# EAGLE design SingleMotor (EAGLE 6.6.0)
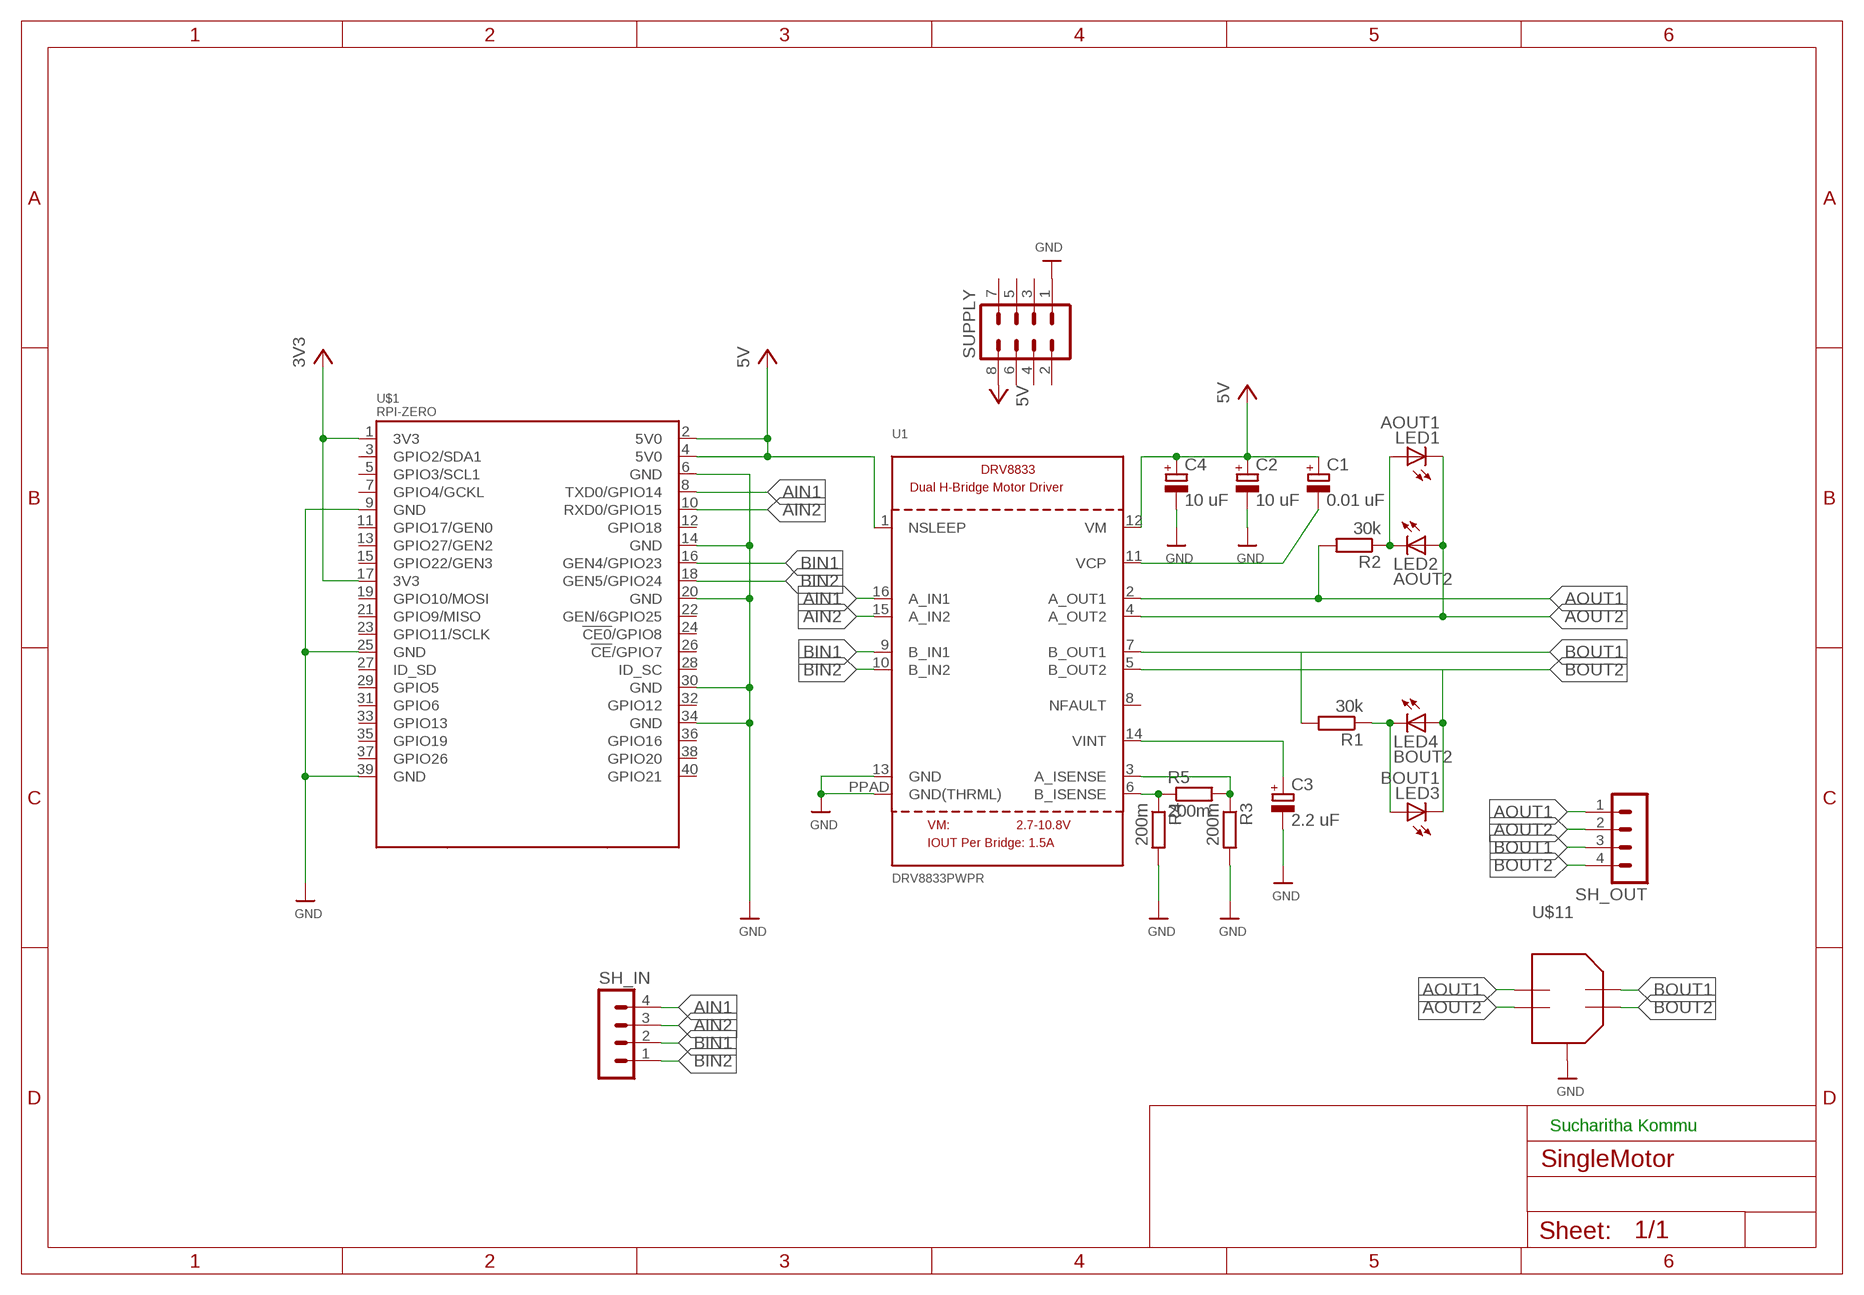
[diagram p0: schematic, sheet 1]

## Parts
C1  0.01 uF  CPOL-EUSMCC  [SMC_C]
C2  10 uF  CPOL-EUE2.5-6  [E2,5-6]
C3  2.2 uF  CPOL-EUSMCC  [SMC_C]
C4  10 uF  CPOL-EUE3.5-8  [E3,5-8]
LED1  AOUT1  LED5MM  [LED5MM]
LED2  AOUT2  LED5MM  [LED5MM]
LED3  BOUT1  LED5MM  [LED5MM]
LED4  BOUT2  LED5MM  [LED5MM]
R1  30k  R-EU_0204/2V  [0204V]
R2  30k  R-EU_0204/2V  [0204V]
R3  200m  R-EU_0204/2V  [0204V]
R4  200m  R-EU_0204/2V  [0204V]
R5  200m  R-EU_0204/2V  [0204V]
SH_IN  MA04-1  [MA04-1]
SH_OUT  MA04-1  [MA04-1]
SUPPLY  MA04-2  [MA04-2]
U1  DRV8833PWPR  DRV8833  [HTSSOP16]
U$1  RPI-ZERO  [RASPBERRYPI_BASTELSTUBE_V13_RASPI_BOARD_B+_FULL]
U$11  M80-85104XX"  [M80-85104XX]

## Nets
3V3: U$1.1(3V3) U$1.17(3V3)
5V: U1.1(NSLEEP) U$1.2(5V0) U$1.4(5V0)
AIN1: SH_IN.4 U1.16(A_IN1) U$1.8(TXD0/GPIO14)
AIN2: SH_IN.3 U1.15(A_IN2) U$1.10(RXD0/GPIO15)
AOUT1: R2.2 SH_OUT.1 U1.2(A_OUT1) U$11.P1
AOUT2: LED1.K(C) LED2.A SH_OUT.2 U1.4(A_OUT2) U$11.P3
BIN1: SH_IN.2 U1.9(B_IN1) U$1.16(GEN4/GPIO23)
BIN2: SH_IN.1 U1.10(B_IN2) U$1.18(GEN5/GPIO24)
BOUT1: R1.2 SH_OUT.3 U1.7(B_OUT1) U$11.P2
BOUT2: LED3.K(C) LED4.A SH_OUT.4 U1.5(B_OUT2) U$11.P4
GND: C1.- C2.- C3.- C4.- R3.2 R4.2 SUPPLY.1 U1.11(VCP) U1.13(GND) U1.PPAD(GND(THRML)) U$1.6(GND) U$1.9(GND) U$1.14(GND) U$1.20(GND) U$1.25(GND) U$1.30(GND) U$1.34(GND) U$1.39(GND) U$11.CASE1(CASE) U$11.CASE2(CASE) U$11.CASE3(CASE) U$11.CASE4(CASE)
N$5: LED1.A LED2.K(C) R2.1
N$7: LED3.A LED4.K(C) R1.1
N$11: C3.+ U1.14(VINT)
N$12: R3.1 R5.2 U1.3(A_ISENSE)
N$13: R4.1 R5.1 U1.6(B_ISENSE)
VCC: C1.+ C2.+ C4.+ SUPPLY.8 U1.12(VM) ; supply symbol labelled 5V
Unconnected: SUPPLY.2 SUPPLY.3 SUPPLY.4 SUPPLY.5 SUPPLY.6 SUPPLY.7 U1.8(NFAULT) U$1.3(GPIO2/SDA1) U$1.5(GPIO3/SCL1) U$1.7(GPIO4/GCKL) U$1.11(GPIO17/GEN0) U$1.12(GPIO18) U$1.13(GPIO27/GEN2) U$1.15(GPIO22/GEN3) U$1.19(GPIO10/MOSI) U$1.21(GPIO9/MISO) U$1.22(GEN/6GPIO25) U$1.23(GPIO11/SCLK) U$1.24(!CE0!/GPIO8) U$1.26(!CE!/GPIO7) U$1.27(ID_SD) U$1.28(ID_SC) U$1.29(GPIO5) U$1.31(GPIO6) U$1.32(GPIO12) U$1.33(GPIO13) U$1.35(GPIO19) U$1.36(GPIO16) U$1.37(GPIO26) U$1.38(GPIO20) U$1.40(GPIO21)

## Notes on the sheet
- Sucharitha Kommu

## Library data of the parts
C1 C3 = resistor:CPOL-EU: POLARIZED CAPACITOR, European symbol
C2 C4 = rcl:CPOL-EU: POLARIZED CAPACITOR, European symbol
LED1-LED4 = led:LED: LED OSRAM: - CHIPLED LG R971, LG N971, LY N971, LG Q971, LY Q971, LO R971, LY R971 LH N974, LH R974 LS Q976, LO Q976, LY Q976 LO Q996 - Hyper CHIPLED LW Q18S LB Q993, LB Q99A, LB R99A - SideLED LS A670, LO A670, LY A670, LG A670, LP A670 LB A673, LV A673, LT A673, LW A673 LH A674 LY A675 LS A676, LA A676, LO A676, LY A676, LW A676 LS A679, LY A679, LG A679 - Hyper Micro SIDELED® LS Y876, LA Y876, LO Y876, LY Y876 LT Y87S - SmartLED LW L88C, LW L88S LB L89C, LB L89S, LG L890 LS L89K, LO L89K, LY L89K LS L896, LA L896, LO L896, LY L896 - TOPLED LS T670, LO T670, LY T670, LG T670, LP T670 LSG T670, LSP T670, LSY T670, LOP T670, LYG T670 LG T671, LOG T671, LSG T671 LB T673, LV T673, LT T673, LW T673 LH T674 LS T676, LA T676, LO T676, LY T676, LB T676, LH T676, LSB T676, LW T676 LB T67C, LV T67C, LT T67C, LS T67K, LO T67K, LY T67K, LW E67C LS E67B, LA E67B, LO E67B, LY E67B, LB E67C, LV E67C, LT E67C LW T67C LS T679, LY T679, LG T679 LS T770, LO T770, LY T770, LG T770, LP T770 LB T773, LV T773, LT T773, LW T773 LH T774 LS E675, LA E675, LY E675, LS T675 LS T776, LA T776, LO T776, LY T776, LB T776 LHGB T686 LT T68C, LB T68C - Hyper Mini TOPLED® LB M676 - Mini TOPLED Santana® LG M470 LS M47K, LO M47K, LY M47K Source: http://www.osram.convergy.de LUXEON: - LUMILED® LXK2-PW12-R00, LXK2-PW12-S00, LXK2-PW14-U00, LXK2-PW14-V00 LXK2-PM12-R00, LXK2-PM12-S00, LXK2-PM14-U00 LXK2-PE12-Q00, LXK2-PE12-R00, LXK2-PE12-S00, LXK2-PE14-T00, LXK2-PE14-U00 LXK2-PB12-K00, LXK2-PB12-L00, LXK2-PB12-M00, LXK2-PB14-N00, LXK2-PB14-P00, LXK2-PB14-Q00 LXK2-PR12-L00, LXK2-PR12-M00, LXK2-PR14-Q00, LXK2-PR14-R00 LXK2-PD12-Q00, LXK2-PD12-R00, LXK2-PD12-S00 LXK2-PH12-R00, LXK2-PH12-S00 LXK2-PL12-P00, LXK2-PL12-Q00, LXK2-PL12-R00 Source: www.luxeon.com KINGBRIGHT: KA-3528ASYC Source: www.kingbright.com
R1-R5 = rcl:R-EU_: RESISTOR, European symbol
SH_IN SH_OUT = con-lstb:MA04-1: PIN HEADER; OC_FARNELL: unknown; OC_NEWARK: unknown
SUPPLY = con-lstb:MA04-2: PIN HEADER; OC_FARNELL: unknown; OC_NEWARK: unknown
U1 = microbuilder:DRV8833: DRV8833 Dual H-Bridge Motor Driver -- HTSSOP Package
U$1 = RPI-Zero:RPI-ZERO
U$11 = Harwin:M80-85104XX

## Board
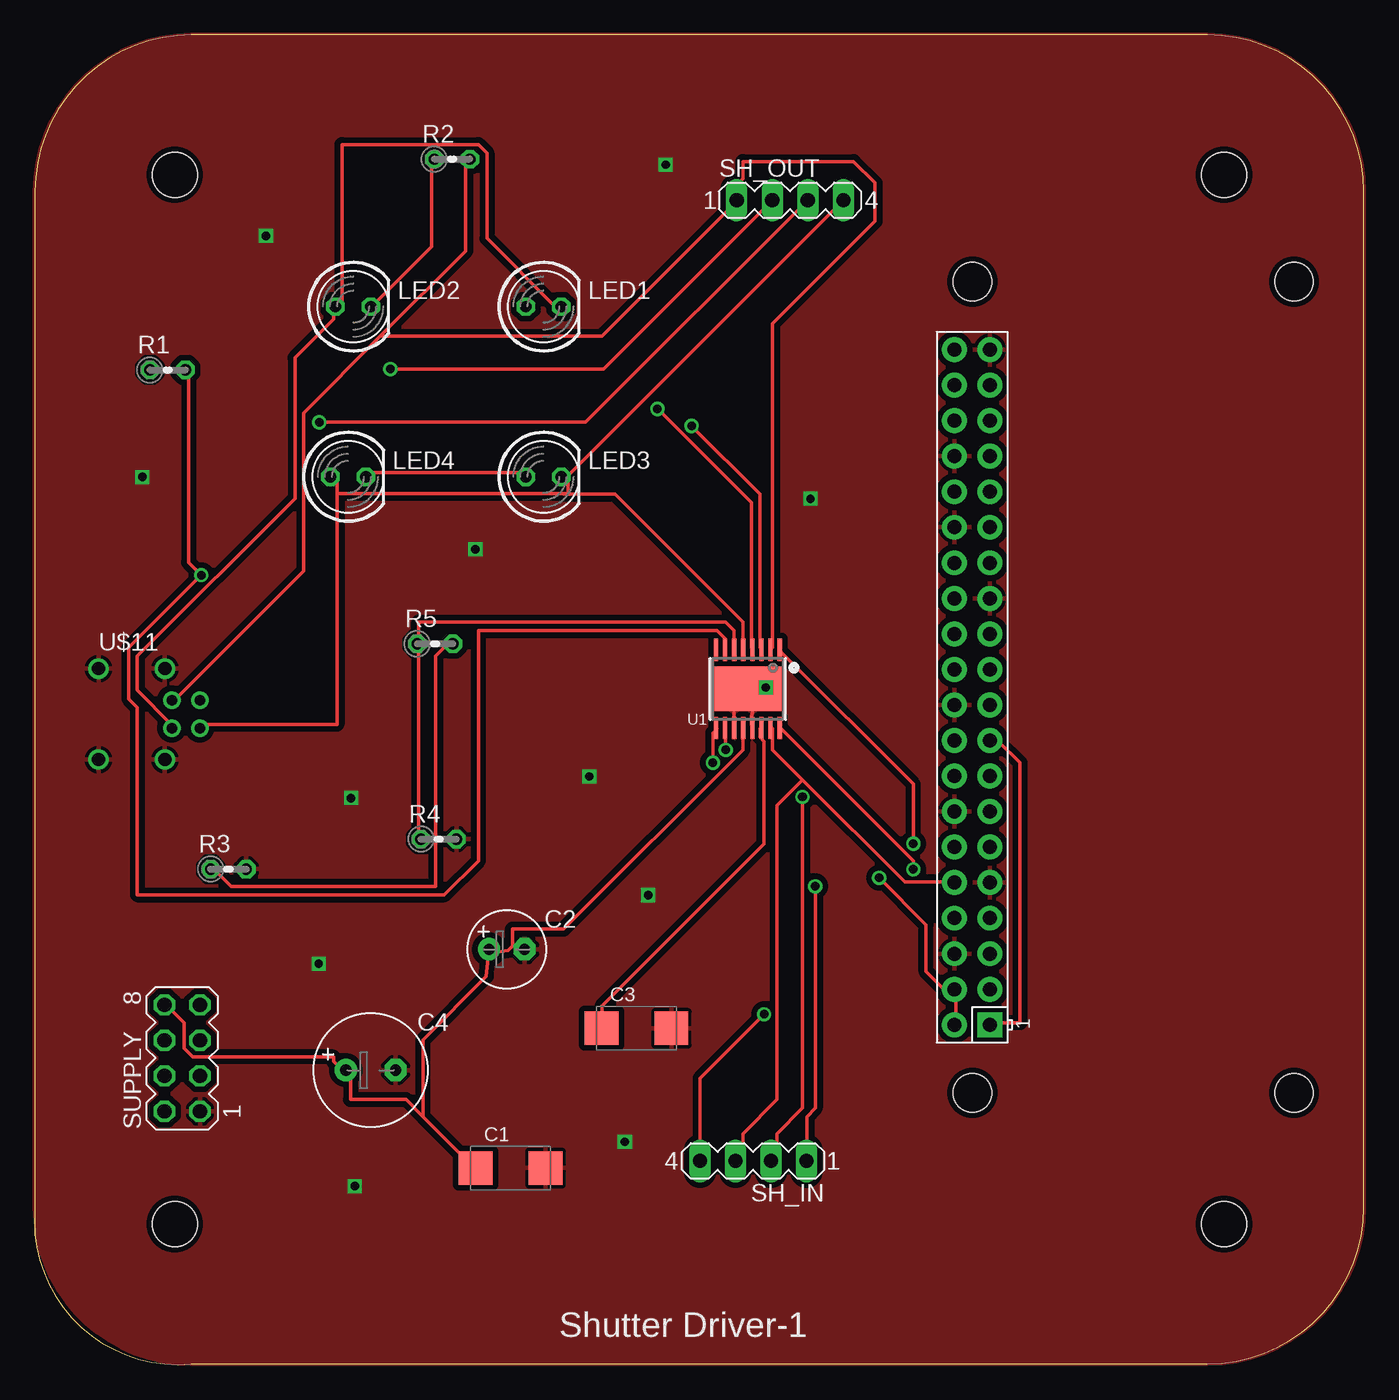
[diagram p1: board, top side]
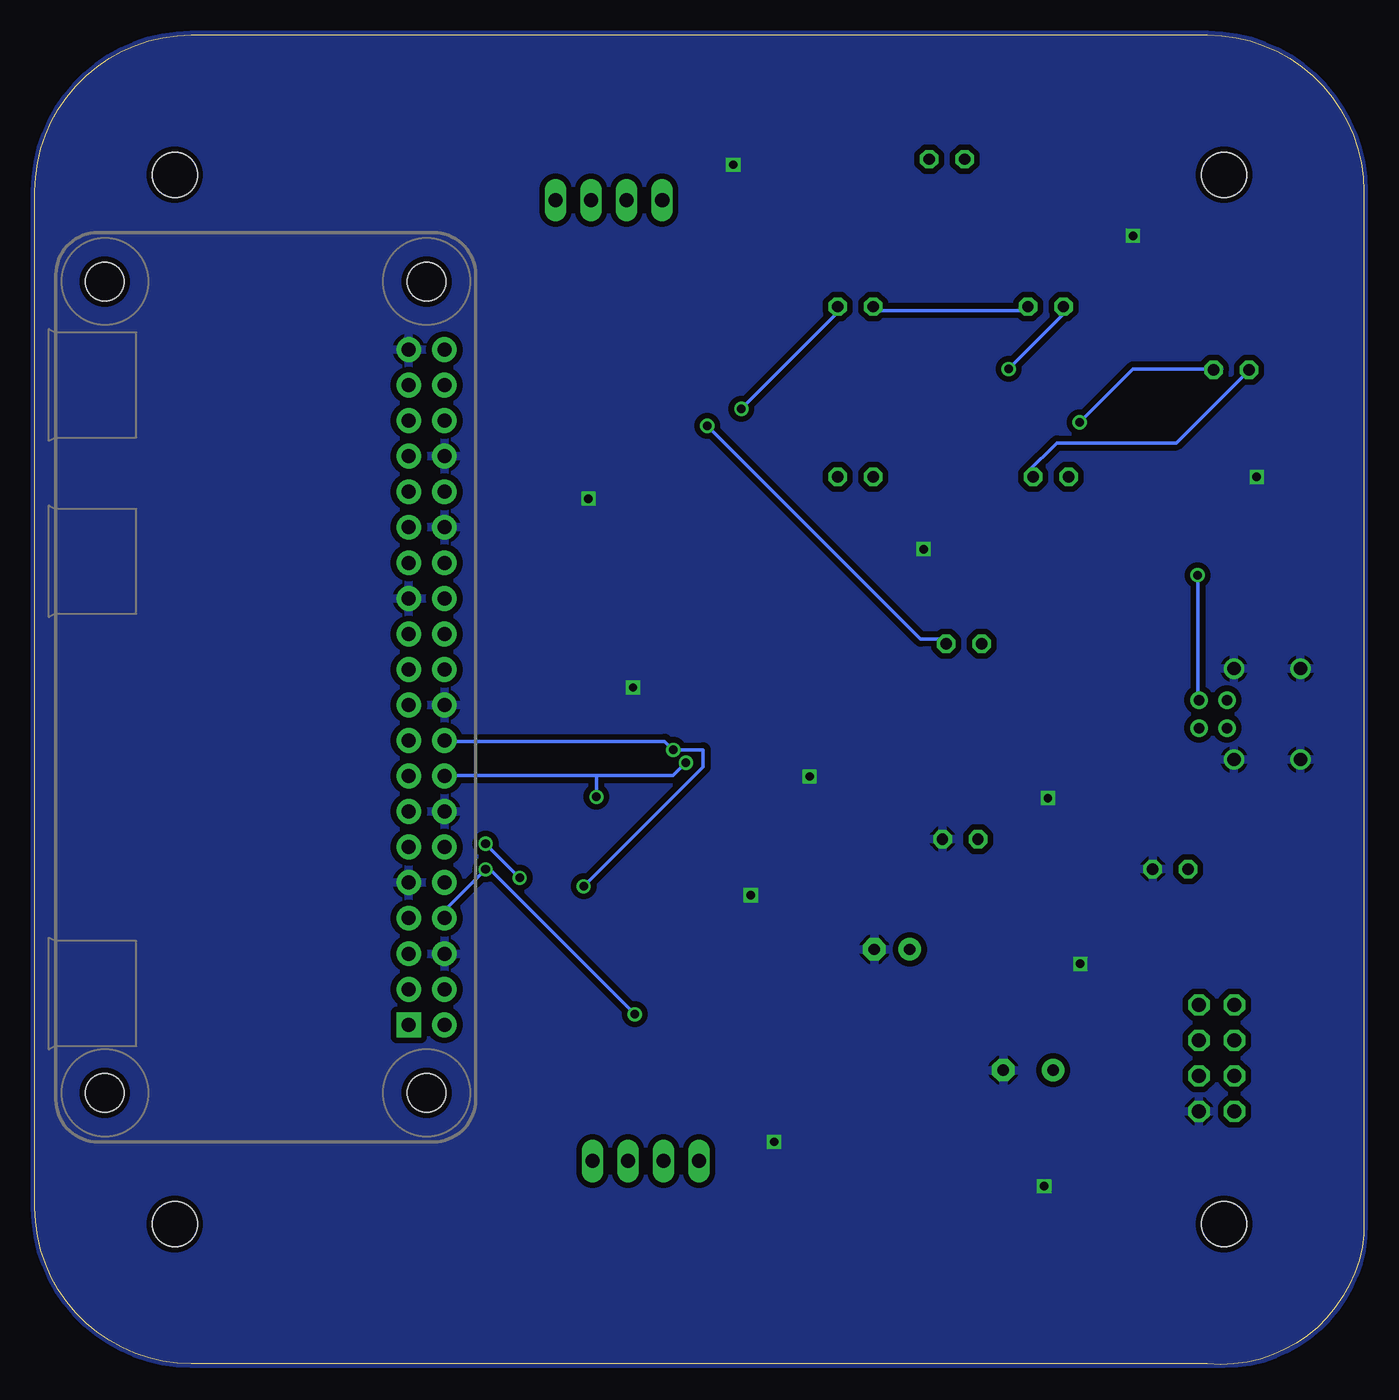
[diagram p2: board, bottom side, seen from below]

Size 95 x 95.04 mm. Coordinates in mm from the lower left corner, seen from the top.
Outline: 83.82,95.04 11.18,95.04 arc90 0,83.86 0,9.32 arc90 11.18,0.04 83.82,0.04 arc90 95,11.22 95,83.86 arc90 83.82,95.04
Copper layers (1*16): Top 0.035mm / dielectric 1.5mm / Bottom 0.035mm
Design rules "default *": minimum track width 10mil, minimum drill 24mil, track to track 8mil, track to pad 8mil, pad to pad 8mil, via to via 8mil, smd to smd 8mil, copper to edge 0mil, drill to drill 8mil, minimum pad ring 10mil, minimum via ring 8mil, stop-mask expansion 4mil, vias tented up to drill 0mil, thermal gap 10mil
Holes 3.2 mm at 10,85.04 10,10.04 85,10.04 85,85.04

### Footprints (pad centres in the part's own frame; a part is rotated, then mirrored left to right if it is on the bottom)
SMC_C = smd 2.4 x 2.4: + -2.5,0; - 2.5,0
E2,5-6 = drill 0.813 pad 1.6: + -1.27,0 | drill 0.813 pad 1.6 octagon: - 1.27,0
E3,5-8 = drill 0.813 pad 1.6: + -1.778,0 | drill 0.813 pad 1.6 octagon: - 1.778,0
LED5MM = drill 0.813 octagon: A -1.27,0; K 1.27,0
0204V = drill 0.813 octagon: 1 -1.27,0; 2 1.27,0
MA04-1 = drill 1.016 long: 1 -3.81,0; 2 -1.27,0; 3 1.27,0; 4 3.81,0
MA04-2 = drill 1.016 octagon: 1 -3.81,-1.27; 2 -3.81,1.27; 3 -1.27,-1.27; 4 -1.27,1.27; 5 1.27,-1.27; 6 1.27,1.27; 7 3.81,-1.27; 8 3.81,1.27
HTSSOP16 = smd 0.3 x 1.6: 1 -2.275,-2.8; 2 -1.625,-2.8; 3 -0.975,-2.8; 4 -0.325,-2.8; 5 0.325,-2.8; 6 0.975,-2.8; 7 1.625,-2.8; 8 2.275,-2.8; 9 2.275,2.8; 10 1.625,2.8; 11 0.975,2.8; 12 0.325,2.8; 13 -0.325,2.8; 14 -0.975,2.8; 15 -1.625,2.8; 16 -2.275,2.8 | smd 4.8 x 3.2: PPAD 0,0
RASPBERRYPI_BASTELSTUBE_V13_RASPI_BOARD_B+_FULL = drill 1 pad 1.778 square: 1 8.37,25.23 | drill 1 pad 1.778: 2 8.37,27.77; 3 10.91,25.23; 4 10.91,27.77; 5 13.45,25.23; 6 13.45,27.77; 7 15.99,25.23; 8 15.99,27.77; 9 18.53,25.23; 10 18.53,27.77; 11 21.07,25.23; 12 21.07,27.77; 13 23.61,25.23; 14 23.61,27.77; 15 26.15,25.23; 16 26.15,27.77; 17 28.69,25.23; 18 28.69,27.77; 19 31.23,25.23; 20 31.23,27.77; 21 33.77,25.23; 22 33.77,27.77; 23 36.31,25.23; 24 36.31,27.77; 25 38.85,25.23; 26 38.85,27.77; 27 41.39,25.23; 28 41.39,27.77; 29 43.93,25.23; 30 43.93,27.77; 31 46.47,25.23; 32 46.47,27.77; 33 49.01,25.23; 34 49.01,27.77; 35 51.55,25.23; 36 51.55,27.77; 37 54.09,25.23; 38 54.09,27.77; 39 56.63,25.23; 40 56.63,27.77 | hole 2.75: 3.5,3.5; 3.5,26.5; 61.5,3.5; 61.5,26.5
M80-85104XX = drill 0.95: CASE1 0,0; CASE2 0,4.75; CASE3 6.5,0; CASE4 6.5,4.75 | drill 0.75: P1 2.25,5.25; P2 2.25,7.25; P3 4.25,5.25; P4 4.25,7.25

### Placement (x,y rotation side)
C1  34,14.04 0 top
C2  33.73,29.68 0 top
C3  43,24.04 0 top
C4  24,21.04 0 top
LED1  36.35,75.62 0 top
LED2  22.75,75.62 0 top
LED3  36.35,63.46 0 top
LED4  22.39,63.46 0 top
R1  9.48,71.1 0 top
R2  29.82,86.16 0 top
R3  13.83,35.41 0 top
R4  28.86,37.55 0 top
R5  28.59,51.52 0 top
SH_IN  51.34,14.55 180 top
SH_OUT  53.98,83.23 0 top
SUPPLY  10.53,21.9 90 top
U1  50.96,48.3 180 top
U$1  93.5,15.92 90 top
U$11  4.54,49.75 270 top

### Tracks (layer width: path | path; a pad name or v marks a point on that pad's centre or on a via)
3V3
  Top 0.254: U$1.1 68.28,24.43 70.41,24.43 70.41,43.02 68.89,44.55 68.28,44.55 U$1.17
5V  (via drill 0.61)
  Top 0.254: 65.84,25.95 65.84,26.56 U$1.4 65.84,25.95 | 65.84,25.95 65.84,24.43 U$1.2 | v62.79,37.23 62.79,41.5 53.34,50.95 U1.1 | v60.35,34.79 63.7,31.44 63.7,28.09 65.84,25.95
  Bottom 0.254: v60.35,34.79 v62.79,37.23
AIN1  (via drill 0.61)
  Top 0.254: v62.79,35.4 62.79,36.01 53.34,45.46 U1.16 | v52.12,25.04 47.55,20.47 47.55,14.67 SH_IN.4
  Bottom 0.254: U$1.8 65.53,32.05 65.53,32.66 v62.79,35.4 62.48,35.4 v52.12,25.04
AIN2
  Top 0.254: 54.86,41.8 62.18,34.49 65.53,34.49 U$1.10 | 54.86,41.8 52.73,43.94 52.73,45.46 U1.15 | 54.86,41.8 53.03,39.97 53.03,18.94 50.6,16.5 50.6,14.98 50.29,14.67 SH_IN.3
AOUT1
  Top 0.254: U1.2 52.73,51.25 52.73,74.42 60.05,81.73 60.05,84.47 58.52,86 50.6,86 50.6,84.78 50.29,84.47 50.29,83.25 SH_OUT.1 49.99,82.95 40.54,73.5 24.69,73.5 | 24.69,73.5 30.79,79.6 30.79,86 R2.2 | 24.69,73.5 19.2,68.01 19.2,56.74 10.06,47.59 U$11.P1
AOUT2  (via drill 0.61)
  Top 0.254: U$11.P3 9.75,45.76 7.32,48.2 7.32,50.64 18.59,61.92 18.59,71.98 21.34,74.72 21.34,75.33 LED2.A 21.95,75.63 21.95,87.22 31.7,87.22 32.31,86.61 32.31,80.51 37.19,75.63 LED1.K | SH_OUT.2 40.64,71.16 v25.4,71.16 | v44.5,68.32 51.21,61.61 51.21,51.25 U1.4
  Bottom 0.254: v25.4,71.16 21.59,74.97 LED2.A | v44.5,68.32 37.8,75.03 LED1.K
BIN1  (via drill 0.61)
  Top 0.254: v48.46,43.02 48.46,45.15 48.77,45.46 U1.9 | SH_IN.2 53.03,14.98 53.03,16.5 54.86,18.33 v54.86,40.58
  Bottom 0.254: v48.46,43.02 49.38,42.11 54.86,42.11 | 54.86,42.11 65.53,42.11 U$1.16 | 54.86,42.11 v54.86,40.58
BIN2  (via drill 0.61)
  Top 0.254: v49.38,43.94 49.38,45.46 U1.10 | v55.78,34.18 55.78,18.33 55.17,17.72 55.17,14.67 SH_IN.1
  Bottom 0.254: U$1.18 65.53,44.55 49.99,44.55 v49.38,43.94 47.24,43.94 47.24,42.72 v55.78,34.18
BOUT1  (via drill 0.61)
  Top 0.254: R1.2 10.97,71.06 10.97,57.35 v11.89,56.43 6.71,51.25 6.71,47.59 7.32,46.98 7.32,33.57 29.26,33.57 31.7,36.01 31.7,52.47 48.77,52.47 49.38,51.86 49.38,51.25 U1.7 | SH_OUT.3 39.37,67.35 v20.32,67.35
  Bottom 0.254: v11.89,56.43 11.89,47.59 U$11.P2 | v20.32,67.35 16.51,71.16 10.16,71.16 R1.2
BOUT2
  Top 0.254: 21.59,62.27 21.59,63.54 LED4.A | 21.59,62.27 21.59,45.76 11.43,45.76 U$11.P4 | SH_OUT.4 38.1,63.54 | 37.8,62.27 38.1,62.27 38.1,63.54 | 37.8,62.27 21.59,62.27 | 38.1,63.54 LED3.K | U1.5 50.6,51.25 50.6,53.08 41.45,62.22 37.8,62.22 37.8,62.27
GND  (via drill 0.6, 0.61)
  Top 0.254: U1.11 49.99,45.76 49.99,46.37 49.98,46.59 | 51.28,46.59 51.21,46.37 51.21,45.76 U1.13
  other vias: 39.62,42.03 55.44,61.89 45.09,85.77 42.16,15.92 22.86,12.74 31.48,58.29 16.51,80.69 7.67,63.44 20.27,28.65 43.83,33.55 52.24,48.4 22.59,40.49
  pour Bottom (isolate 0.406): 0,83.86 0,11.22 arc90 11.18,0.04 83.82,0.04 arc90 95,11.22 95,83.86 arc90 83.82,95.04 11.18,95.04 arc90
  pour Bottom (isolate 0.406): 0,83.86 0,10.04 arc90 10,0.04 83.82,0.04 arc90 95,11.22 95,83.86 arc90 83.82,95.04 11.18,95.04 arc90
  pour Top (isolate 0.406): 0,83.86 0,11.22 arc90 11.18,0.04 83.82,0.04 arc90 95,11.22 95,83.86 arc90 83.82,95.04 11.18,95.04 arc90
N$5
  Top 0.254: LED2.K 24.08,75.63 28.35,79.9 28.35,86 R2.1
  Bottom 0.254: LED1.A 35.05,75.33 24.08,75.33 LED2.K
N$7
  Top 0.254: LED4.K 23.77,63.75 35.05,63.75 LED3.A
  Bottom 0.254: R1.1 8.23,71.06 13.41,65.88 21.95,65.88 24.08,63.75 24.08,63.44 23.77,63.44 LED4.K
N$11
  Top 0.254: U1.14 51.82,45.46 51.82,44.85 52.12,44.55 52.12,37.23 40.54,25.65 40.54,24.12 C3.+
N$12  (via drill 0.61)
  Top 0.254: v46.94,67.1 51.82,62.22 51.82,51.25 U1.3 | R3.1 12.8,35.4 14.02,34.18 28.65,34.18 28.65,50.64 29.26,51.25 R5.2
  Bottom 0.254: v46.94,67.1 31.7,51.86 29.87,51.86 R5.2
N$13
  Top 0.254: U1.6 49.99,51.25 49.99,52.47 49.38,53.08 27.43,53.08 27.43,51.86 R5.1 27.43,51.25 27.43,37.84 R4.1
VCC
  Top 0.254: U1.12 50.6,45.46 50.6,43.94 37.8,31.13 34.14,31.13 34.14,29.91 33.83,29.61 31.93,29.31 C2.+ 32.26,27.73 27.74,23.21 27.74,17.72 | 27.74,17.72 26.52,18.94 22.55,18.94 22.55,20.47 22.25,20.77 C4.+ 21.95,21.08 21.34,21.69 21.34,21.99 11.28,21.99 10.67,22.6 10.67,24.43 9.45,25.65 SUPPLY.8 | 27.74,17.72 31.39,14.07 C1.+

### Text on the board
tPlace: Shutter Driver-1